# Altium schematic sheet CLK_Block.SchDoc
size A4; SheetNumber: 11; SheetTotal: 15
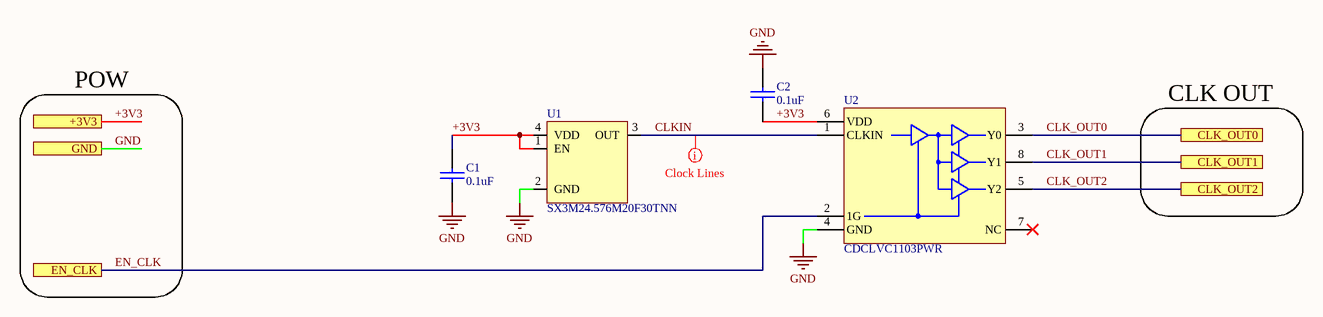
[diagram p0: CLK_Block.SchDoc]

## Parts
C1  0.1uF  [0402-CAP-TDK]
C2  0.1uF  [0402-CAP-TDK]
U1  SX3M24.576M20F30TNN  [SMD3225]
U2  CDCLVC1103PWR  [TI-TSSOP-8-PW0008A]

## Ports
+3V3, CLK_OUT0, CLK_OUT1, CLK_OUT2, EN_CLK, GND

## Nets
GND: C1.1 C2.2 U1.2(GND) U2.4(GND) ; port GND
+3V3: C1.2 C2.1 U1.1(EN) U1.4(VDD) U2.6(VDD) ; port +3V3
CLK_OUT0: U2.3(Y0) ; port CLK_OUT0
CLK_OUT1: U2.8(Y1) ; port CLK_OUT1
CLK_OUT2: U2.5(Y2) ; port CLK_OUT2
CLKIN: U1.3(OUT) U2.1(CLKIN)
EN_CLK: U2.2(1G) ; port EN_CLK

Not connected (* = marked no-connect by the designer): U2 7(NC)*

## Layout directives
net class CLK: CLKIN

## Notes on the sheet
- POW
- CLK OUT

## Library data of the parts
C1 C2 = CAP-SMD: JLCPart: C307331
U1 = SX3M24.576M20F30TNN: 1.62V-3.63V ±20ppm 24.576MHz SMD3225-4P Oscillators; JLCPart: C2901574
U2 = CDCLVC1103PWR: LVCMOS High-Performance Clock Buffer 3-Output; JLCPart: C555453